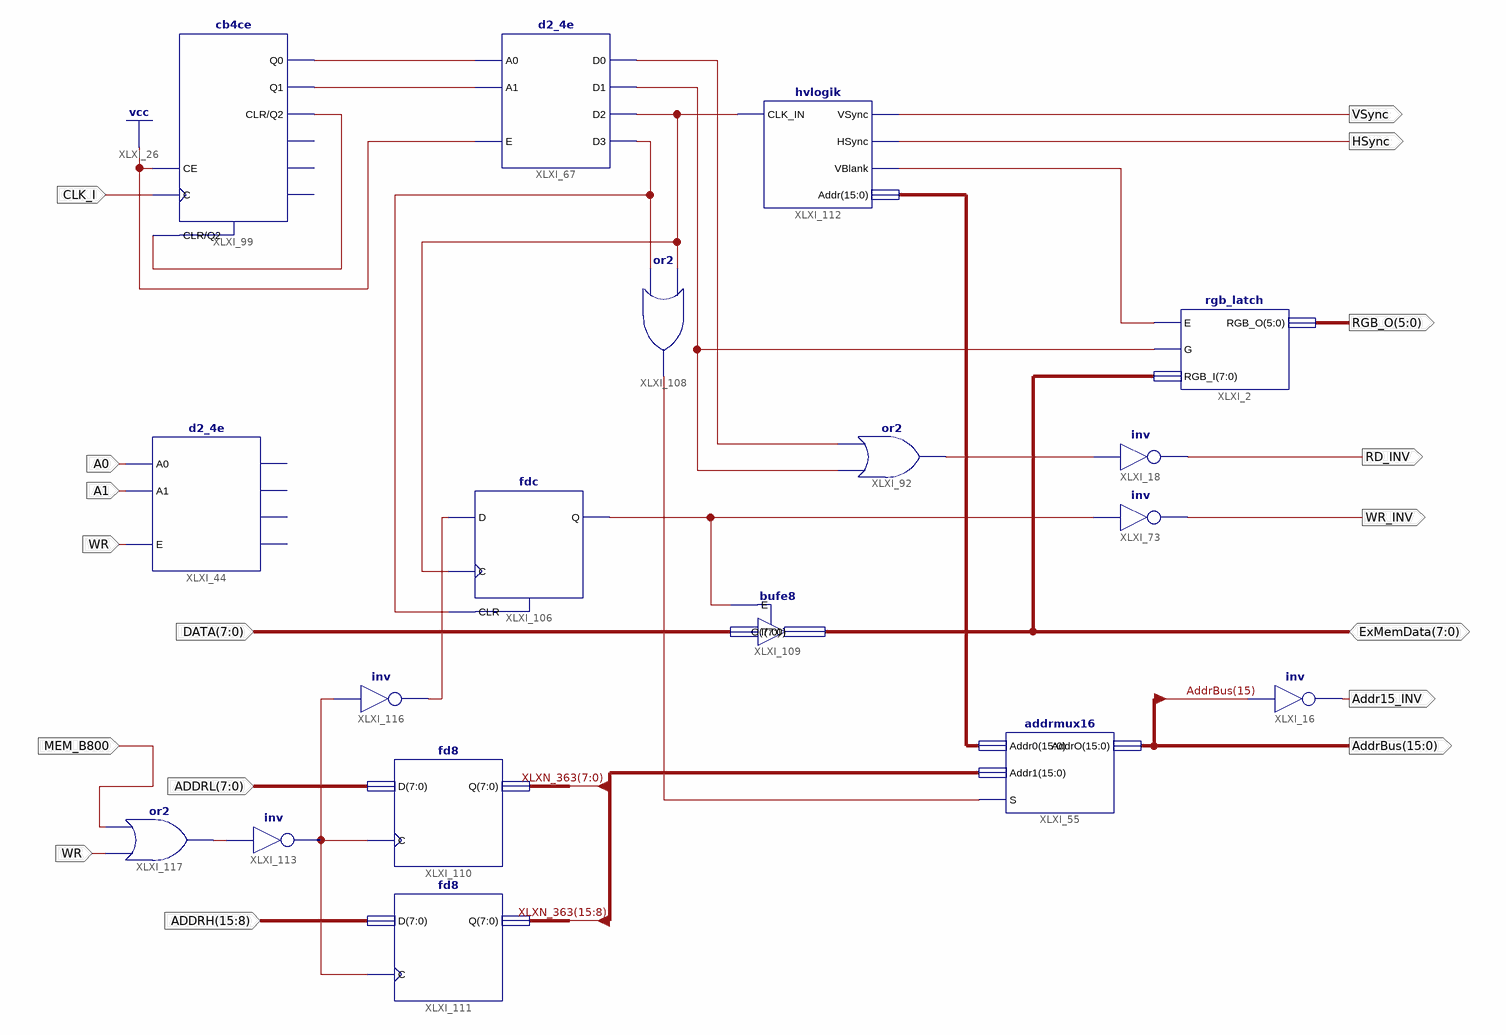
[diagram p0: schematic sheet 1]
// Xilinx ISE schematic graka.sch (xc9500) as structural Verilog: 18 symbols, 16 ports
module graka (
  input  A0,
  input  A1,
  input  WR,
  input  CLK_I,
  input  [7:0] ADDRL,
  input  [15:8] ADDRH,
  input  [7:0] DATA,
  input  MEM_B800,
  inout  [7:0] ExMemData,
  output HSync,
  output VSync,
  output [15:0] AddrBus,
  output WR_INV,
  output RD_INV,
  output Addr15_INV,
  output [5:0] RGB_O
);

  wire XLXN_165, XLXN_214, XLXN_277, XLXN_290, XLXN_311, XLXN_312, XLXN_322, XLXN_325, XLXN_326, XLXN_329,
       XLXN_330, XLXN_378, XLXN_379, XLXN_380;
  wire [15:0] A, XLXN_363;

  not XLXI_18 (RD_INV, XLXN_290);
  not XLXI_16 (Addr15_INV, AddrBus[15]);
  addrmux16 XLXI_55 (.Addr0(A), .Addr1(XLXN_363), .S(XLXN_325), .AddrO(AddrBus));
  d2_4e XLXI_67 (.A0(XLXN_311), .A1(XLXN_312), .E(1'b1), .D0(XLXN_165), .D1(XLXN_277), .D2(XLXN_329), .D3(XLXN_322));
  rgb_latch XLXI_2 (.E(XLXN_214), .G(XLXN_277), .RGB_I(ExMemData), .RGB_O(RGB_O));
  not XLXI_73 (WR_INV, XLXN_326);
  d2_4e XLXI_44 (.A0(A0), .A1(A1), .E(WR));  // open: D0, D1, D2, D3
  or XLXI_92 (XLXN_290, XLXN_277, XLXN_165);
  cb4ce XLXI_99 (
    .C(CLK_I), .CE(1'b1), .CLR(XLXN_330), .Q0(XLXN_311), .Q1(XLXN_312), .Q2(XLXN_330));  // open: CEO, Q3, TC
  fdc XLXI_106 (.C(XLXN_329), .CLR(XLXN_322), .D(XLXN_379), .Q(XLXN_326));
  or XLXI_108 (XLXN_325, XLXN_322, XLXN_329);
  bufe8 XLXI_109 (.E(XLXN_326), .I(DATA), .O(ExMemData));
  hvlogik XLXI_112 (.CLK_IN(XLXN_329), .VSync(VSync), .HSync(HSync), .VBlank(XLXN_214), .Addr(A));
  fd8 XLXI_110 (.C(XLXN_378), .D(ADDRL), .Q(XLXN_363[7:0]));
  fd8 XLXI_111 (.C(XLXN_378), .D(ADDRH), .Q(XLXN_363[15:8]));
  not XLXI_113 (XLXN_378, XLXN_380);
  not XLXI_116 (XLXN_379, XLXN_378);
  or XLXI_117 (XLXN_380, WR, MEM_B800);
endmodule
